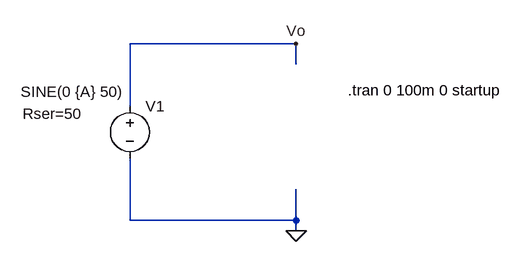
[diagram p0: schematic clipper2.asc]
clipper2.asc, the LTspice schematic file:
Version 4
SHEET 1 880 680
WIRE -240 -48 -496 -48
WIRE -240 -16 -240 -48
WIRE -496 48 -496 -48
WIRE -496 224 -496 128
WIRE -240 224 -240 176
WIRE -240 224 -496 224
WIRE -240 240 -240 224
FLAG -240 240 0
FLAG -240 -48 Vo
SYMBOL voltage -496 32 R0
WINDOW 3 -168 -6 Left 2
WINDOW 123 0 0 Left 2
WINDOW 39 -165 28 Left 2
SYMATTR Value SINE(0 {A} 50)
SYMATTR SpiceLine Rser=50
SYMATTR InstName V1
TEXT -160 24 Left 2 !.tran 0 100m 0 startup

The netlist it stands for:
* clipper2.asc
V1 Vo 0 SINE(0 {A} 50) Rser=50
.tran 0 100m 0 startup
.backanno
.end